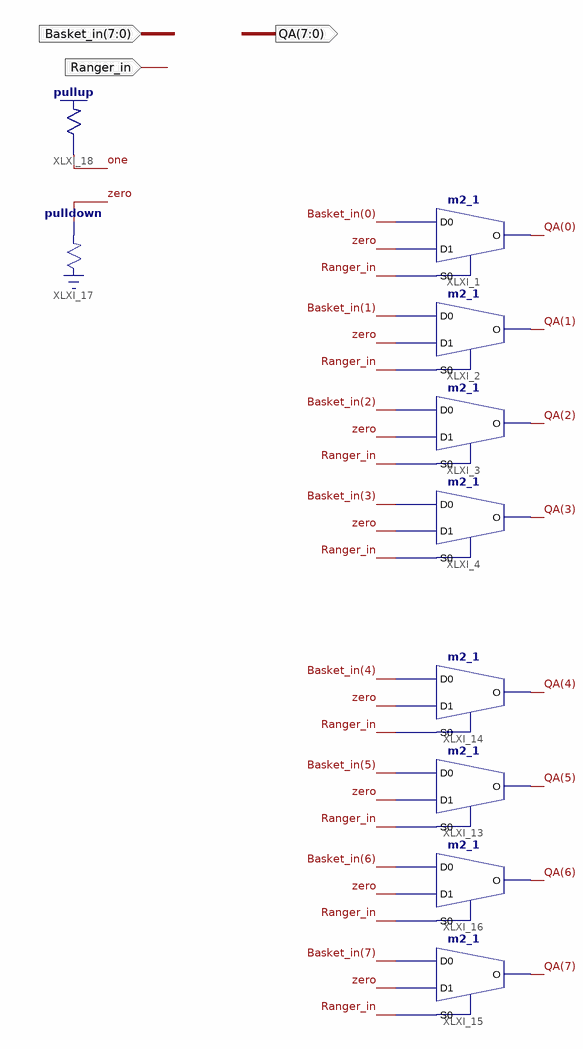
[diagram p0: schematic sheet 1]
// Xilinx ISE schematic muxA.sch (spartan3e) as structural Verilog: 10 symbols, 3 ports
module muxA (
  input  [7:0] Basket_in,
  input  Ranger_in,
  output [7:0] QA
);

  wire one, zero;

  m2_1 XLXI_2 (.D0(Basket_in[1]), .D1(zero), .S0(Ranger_in), .O(QA[1]));
  m2_1 XLXI_1 (.D0(Basket_in[0]), .D1(zero), .S0(Ranger_in), .O(QA[0]));
  m2_1 XLXI_4 (.D0(Basket_in[3]), .D1(zero), .S0(Ranger_in), .O(QA[3]));
  m2_1 XLXI_3 (.D0(Basket_in[2]), .D1(zero), .S0(Ranger_in), .O(QA[2]));
  m2_1 XLXI_13 (.D0(Basket_in[5]), .D1(zero), .S0(Ranger_in), .O(QA[5]));
  m2_1 XLXI_14 (.D0(Basket_in[4]), .D1(zero), .S0(Ranger_in), .O(QA[4]));
  m2_1 XLXI_15 (.D0(Basket_in[7]), .D1(zero), .S0(Ranger_in), .O(QA[7]));
  m2_1 XLXI_16 (.D0(Basket_in[6]), .D1(zero), .S0(Ranger_in), .O(QA[6]));
  \pulldown  XLXI_17 (.O(zero));
  \pullup  XLXI_18 (.O(one));
endmodule
